# EAGLE design dev_board (EAGLE 8.0.1)
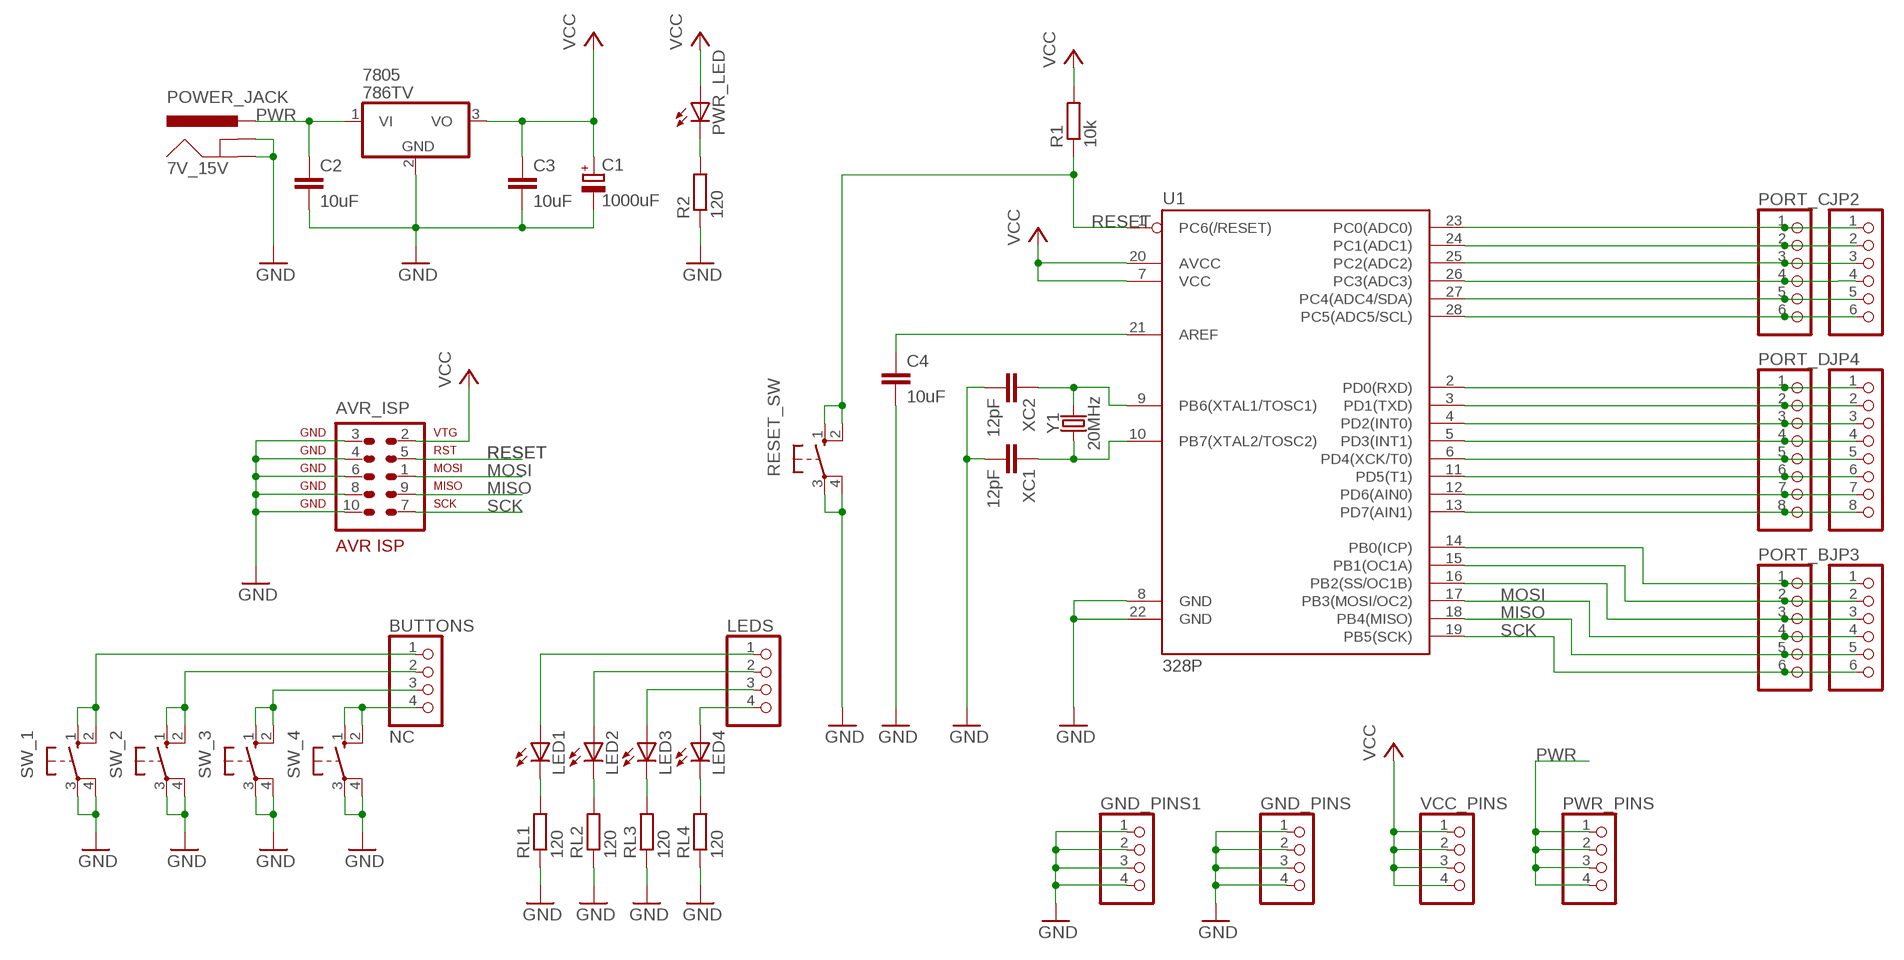
[diagram p0: schematic, sheet 1]

## Parts
7V_15V  POWER_JACK  [POWER_JACK_PTH]
7805  786TV  [TO220V]
AVR_ISP  AVR-ISP-10  [AVR-ISP-10]
BUTTONS  NC  PINHD-1X4  [1X04]
C1  1000uF  CPOL-EUE3.5-10  [E3,5-10]
C2  10uF  C-EU025-025X050  [C025-025X050]
C3  10uF  C-EU025-025X050  [C025-025X050]
C4  10uF  C-EU025-025X050  [C025-025X050]
GND_PINS  PINHD-1X4  [1X04]
GND_PINS1  PINHD-1X4  [1X04]
JP2  PINHD-1X6  [1X06]
JP3  PINHD-1X6  [1X06]
JP4  PINHD-1X8  [1X08]
LED1  LED5MM  [LED5MM]
LED2  LED5MM  [LED5MM]
LED3  LED5MM  [LED5MM]
LED4  LED5MM  [LED5MM]
LEDS  PINHD-1X4  [1X04]
PORT_B  PINHD-1X6  [1X06]
PORT_C  PINHD-1X6  [1X06]
PORT_D  PINHD-1X8  [1X08]
PWR_LED  LED3MM  [LED3MM]
PWR_PINS  PINHD-1X4  [1X04]
R1  10k  R-EU_0207/10  [0207/10]
R2  120  R-EU_0207/10  [0207/10]
RESET_SW  10-XX  [B3F-10XX]
RL1  120  R-EU_0207/10  [0207/10]
RL2  120  R-EU_0207/10  [0207/10]
RL3  120  R-EU_0207/10  [0207/10]
RL4  120  R-EU_0207/10  [0207/10]
SW_1  10-XX  [B3F-10XX]
SW_2  10-XX  [B3F-10XX]
SW_3  10-XX  [B3F-10XX]
SW_4  10-XX  [B3F-10XX]
U1  328P  ATMEGA328P_PDIP  [DIP28]
VCC_PINS  PINHD-1X4  [1X04]
XC1  12pF  C-EU025-025X050  [C025-025X050]
XC2  12pF  C-EU025-025X050  [C025-025X050]
Y1  20MHz  CRYSTALPTH-HC49US  [HC49US]

## Nets
GND: 7V_15V.GND 7V_15V.GNDBREAK 7805.2(GND) AVR_ISP.3 AVR_ISP.4 AVR_ISP.6 AVR_ISP.8 AVR_ISP.10 C1.- C2.2 C3.2 C4.2 GND_PINS1.1 GND_PINS1.2 GND_PINS1.3 GND_PINS1.4 GND_PINS.1 GND_PINS.2 GND_PINS.3 GND_PINS.4 R2.1 RESET_SW.3(P) RESET_SW.4(P1) RL1.1 RL2.1 RL3.1 RL4.1 SW_1.3(P) SW_1.4(P1) SW_2.3(P) SW_2.4(P1) SW_3.3(P) SW_3.4(P1) SW_4.3(P) SW_4.4(P1) U1.8(GND) U1.22(GND) XC1.2 XC2.2
MISO: AVR_ISP.9 JP3.5 PORT_B.5 U1.18(PB4(MISO))
MOSI: AVR_ISP.1 JP3.4 PORT_B.4 U1.17(PB3(MOSI/OC2))
N$2: C4.1 U1.21(AREF)
N$3: JP4.1 PORT_D.1 U1.2(PD0(RXD))
N$4: JP4.2 PORT_D.2 U1.3(PD1(TXD))
N$5: PWR_LED.K(C) R2.2
N$6: JP4.3 PORT_D.3 U1.4(PD2(INT0))
N$7: U1.9(PB6(XTAL1/TOSC1)) XC2.1 Y1.2
N$8: U1.10(PB7(XTAL2/TOSC2)) XC1.1 Y1.1
N$9: JP4.4 PORT_D.4 U1.5(PD3(INT1))
N$10: JP4.5 PORT_D.5 U1.6(PD4(XCK/T0))
N$11: JP4.6 PORT_D.6 U1.11(PD5(T1))
N$12: JP4.7 PORT_D.7 U1.12(PD6(AIN0))
N$13: JP4.8 PORT_D.8 U1.13(PD7(AIN1))
N$14: JP2.6 PORT_C.6 U1.28(PC5(ADC5/SCL))
N$15: JP2.5 PORT_C.5 U1.27(PC4(ADC4/SDA))
N$16: JP2.4 PORT_C.4 U1.26(PC3(ADC3))
N$17: JP2.3 PORT_C.3 U1.25(PC2(ADC2))
N$18: JP2.2 PORT_C.2 U1.24(PC1(ADC1))
N$19: JP2.1 PORT_C.1 U1.23(PC0(ADC0))
N$20: JP3.1 PORT_B.1 U1.14(PB0(ICP))
N$21: JP3.2 PORT_B.2 U1.15(PB1(OC1A))
N$22: JP3.3 PORT_B.3 U1.16(PB2(SS/OC1B))
N$23: LED4.K(C) RL4.2
N$24: LED3.K(C) RL3.2
N$25: LED2.K(C) RL2.2
N$26: LED1.K(C) RL1.2
N$27: LED4.A LEDS.4
N$28: LED3.A LEDS.3
N$29: LED2.A LEDS.2
N$30: LED1.A LEDS.1
N$31: BUTTONS.4 SW_4.1(S) SW_4.2(S1)
N$32: BUTTONS.3 SW_3.1(S) SW_3.2(S1)
N$33: BUTTONS.2 SW_2.1(S) SW_2.2(S1)
N$34: BUTTONS.1 SW_1.1(S) SW_1.2(S1)
PWR: 7V_15V.PWR 7805.1(VI) C2.1 PWR_PINS.1 PWR_PINS.2 PWR_PINS.3 PWR_PINS.4
RESET: AVR_ISP.5 R1.1 RESET_SW.1(S) RESET_SW.2(S1) U1.1(PC6(/RESET))
SCK: AVR_ISP.7 JP3.6 PORT_B.6 U1.19(PB5(SCK))
VCC: 7805.3(VO) AVR_ISP.2 C1.+ C3.1 PWR_LED.A R1.2 U1.7(VCC) U1.20(AVCC) VCC_PINS.1 VCC_PINS.2 VCC_PINS.3 VCC_PINS.4

## Library data of the parts
7V_15V = SparkFun-Connectors:POWER_JACK: Power Jack Connector This is the standard 5.5mm barrel jack for power. The PTH is the most common, proven, reliable, footprint. The Slot footprint only works if the mill layer is transmitted to the PCB fab house so be warned. Here are the connectors we sell at SparkFun: DC Barrel Power Jack/Connector <https://www.sparkfun.com/products/119> (PRT-00119) DC Barrel Power Jack/Connector (SMD) <https://www.sparkfun.com/products/12748> (PRT-12748) DC Barrel Jack Adapter - Breadboard Compatible <https://www.sparkfun.com/products/10811> (PRT-10811) It is used on this SparkFun product (and many, many others): SparkFun RedBoard - Programmed with Arduino <https://www.sparkfun.com/products/12757> (DEV-12757) Also, if you need a mating power supply or connector, please check these out: Wall Adapter Power Supply - 9VDC 650mA <https://www.sparkfun.com/products/298> (TOL-00298) DC Barrel Jack Adapter - Male <https://www.sparkfun.com/products/10287> (PRT-10287); PROD_ID: CONN-08197
7805 = linear:78*: Positive VOLTAGE REGULATOR Source: http://cache.national.com/ds/LM/LM78L05.pdf http://www.fairchildsemi.com/ds/LM/LM7805.pdf
AVR_ISP = atmel:AVR-ISP-10: AVR ISP-10 Serial Programming Header
BUTTONS GND_PINS GND_PINS1 LEDS PWR_PINS VCC_PINS = pinhead:PINHD-1X4: PIN HEADER
C1 = rcl:CPOL-EU: POLARIZED CAPACITOR, European symbol
C2-C4 XC1 XC2 = rcl:C-EU: CAPACITOR, European symbol
JP2 JP3 PORT_B PORT_C = pinhead:PINHD-1X6: PIN HEADER
JP4 PORT_D = pinhead:PINHD-1X8: PIN HEADER
LED1-LED4 PWR_LED = led:LED: LED OSRAM: - CHIPLED LG R971, LG N971, LY N971, LG Q971, LY Q971, LO R971, LY R971 LH N974, LH R974 LS Q976, LO Q976, LY Q976 LO Q996 - Hyper CHIPLED LW Q18S LB Q993, LB Q99A, LB R99A - SideLED LS A670, LO A670, LY A670, LG A670, LP A670 LB A673, LV A673, LT A673, LW A673 LH A674 LY A675 LS A676, LA A676, LO A676, LY A676, LW A676 LS A679, LY A679, LG A679 - Hyper Micro SIDELED® LS Y876, LA Y876, LO Y876, LY Y876 LT Y87S - SmartLED LW L88C, LW L88S LB L89C, LB L89S, LG L890 LS L89K, LO L89K, LY L89K LS L896, LA L896, LO L896, LY L896 - TOPLED LS T670, LO T670, LY T670, LG T670, LP T670 LSG T670, LSP T670, LSY T670, LOP T670, LYG T670 LG T671, LOG T671, LSG T671 LB T673, LV T673, LT T673, LW T673 LH T674 LS T676, LA T676, LO T676, LY T676, LB T676, LH T676, LSB T676, LW T676 LB T67C, LV T67C, LT T67C, LS T67K, LO T67K, LY T67K, LW E67C LS E67B, LA E67B, LO E67B, LY E67B, LB E67C, LV E67C, LT E67C LW T67C LS T679, LY T679, LG T679 LS T770, LO T770, LY T770, LG T770, LP T770 LB T773, LV T773, LT T773, LW T773 LH T774 LS E675, LA E675, LY E675, LS T675 LS T776, LA T776, LO T776, LY T776, LB T776 LHGB T686 LT T68C, LB T68C - Hyper Mini TOPLED® LB M676 - Mini TOPLED Santana® LG M470 LS M47K, LO M47K, LY M47K Source: http://www.osram.convergy.de LUXEON: - LUMILED® LXK2-PW12-R00, LXK2-PW12-S00, LXK2-PW14-U00, LXK2-PW14-V00 LXK2-PM12-R00, LXK2-PM12-S00, LXK2-PM14-U00 LXK2-PE12-Q00, LXK2-PE12-R00, LXK2-PE12-S00, LXK2-PE14-T00, LXK2-PE14-U00 LXK2-PB12-K00, LXK2-PB12-L00, LXK2-PB12-M00, LXK2-PB14-N00, LXK2-PB14-P00, LXK2-PB14-Q00 LXK2-PR12-L00, LXK2-PR12-M00, LXK2-PR14-Q00, LXK2-PR14-R00 LXK2-PD12-Q00, LXK2-PD12-R00, LXK2-PD12-S00 LXK2-PH12-R00, LXK2-PH12-S00 LXK2-PL12-P00, LXK2-PL12-Q00, LXK2-PL12-R00 Source: www.luxeon.com KINGBRIGHT: KA-3528ASYC Source: www.kingbright.com
R1 R2 RL1-RL4 = resistor:R-EU_: RESISTOR, European symbol
RESET_SW SW_1-SW_4 = switch-omron:10-XX: OMRON SWITCH; MPN: B3F-1000; OC_FARNELL: 176432; OC_NEWARK: 36M3542
U1 = SparkFun-IC-Microcontroller:ATMEGA328P_PDIP: Atmel 328P Through hole ATMEGA328P uC used in the Arduino 32kb flash, 1k EEPROM, 2k SRAM Datasheet <http://www.sparkfun.com/datasheets/Components/SMD/ATMega328.pdf> SparkFun Products Storefront component: AVR 28 Pin 20MHz 32K 6A/D - ATMega328P <https://www.sparkfun.com/products/9061> (COM-09061) SparkFun Simon Says - Through-Hole Soldering Kit <https://www.sparkfun.com/products/10547> (KIT-10547) SparkFun Learn to Solder - Simon Says <https://www.sparkfun.com/products/13708> (KIT-13708) SparkFun BigTime Watch Kit <https://www.sparkfun.com/products/11734> (KIT-11734) SparkFun ClockIt <https://www.sparkfun.com/products/10930> (KIT-10930) SparkFun Serial Enabled LCD Kit <https://www.sparkfun.com/products/10097> (LCD-10097) SparkFun Simon Tilts - Through Hole Soldering Kit <https://www.sparkfun.com/products/12634> (KIT-12634) SparkFun Frequency Counter Kit <https://www.sparkfun.com/products/10140> (KIT-10140) FabFM Radio Kit <https://www.sparkfun.com/products/11043> (KIT-11043) SparkFun Binary Blaster Kit <https://www.sparkfun.com/products/12037> (KIT-12037) SparkFun Metro-Gnome <https://www.sparkfun.com/products/9236> (KIT-09236) ATmega328 with Arduino Optiboot (Uno) <https://www.sparkfun.com/products/10524> (DEV-10524); PROD_ID: IC-09136
Y1 = SparkFun-Clocks:CRYSTAL: Crystals (Generic) These are passive quartz crystals, which can be used as a clock source for a microcontroller. Crystal's are two-terminal devices. They require external "load" capacitors to generate an oscillating signal.

## Board
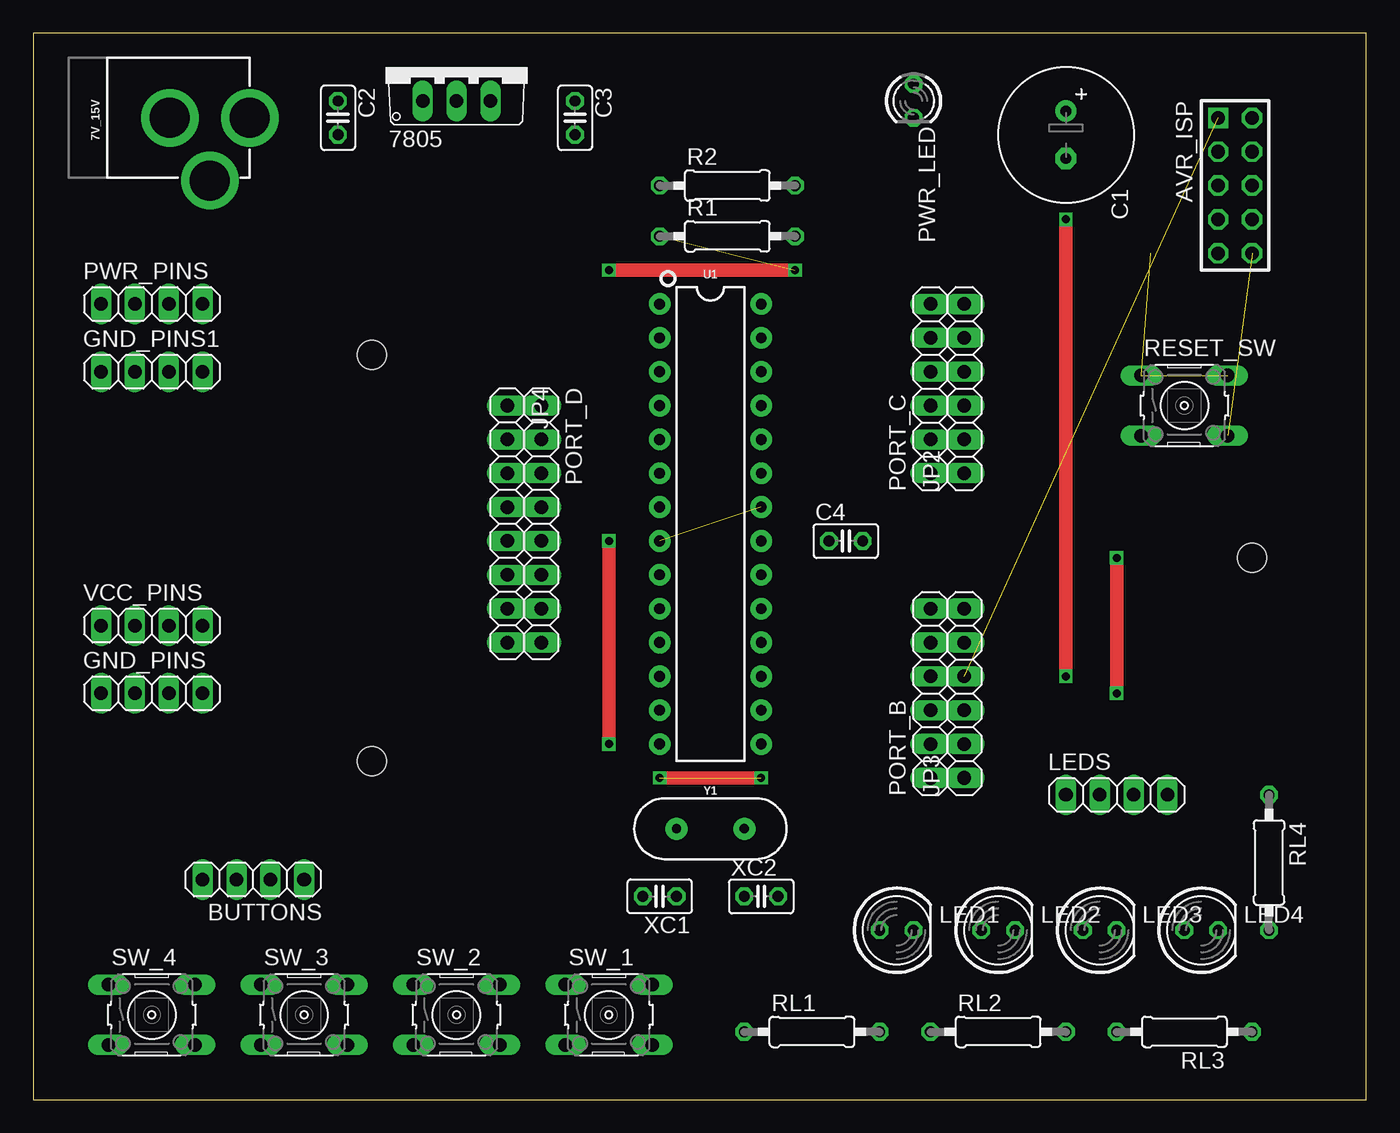
[diagram p1: board, top side]
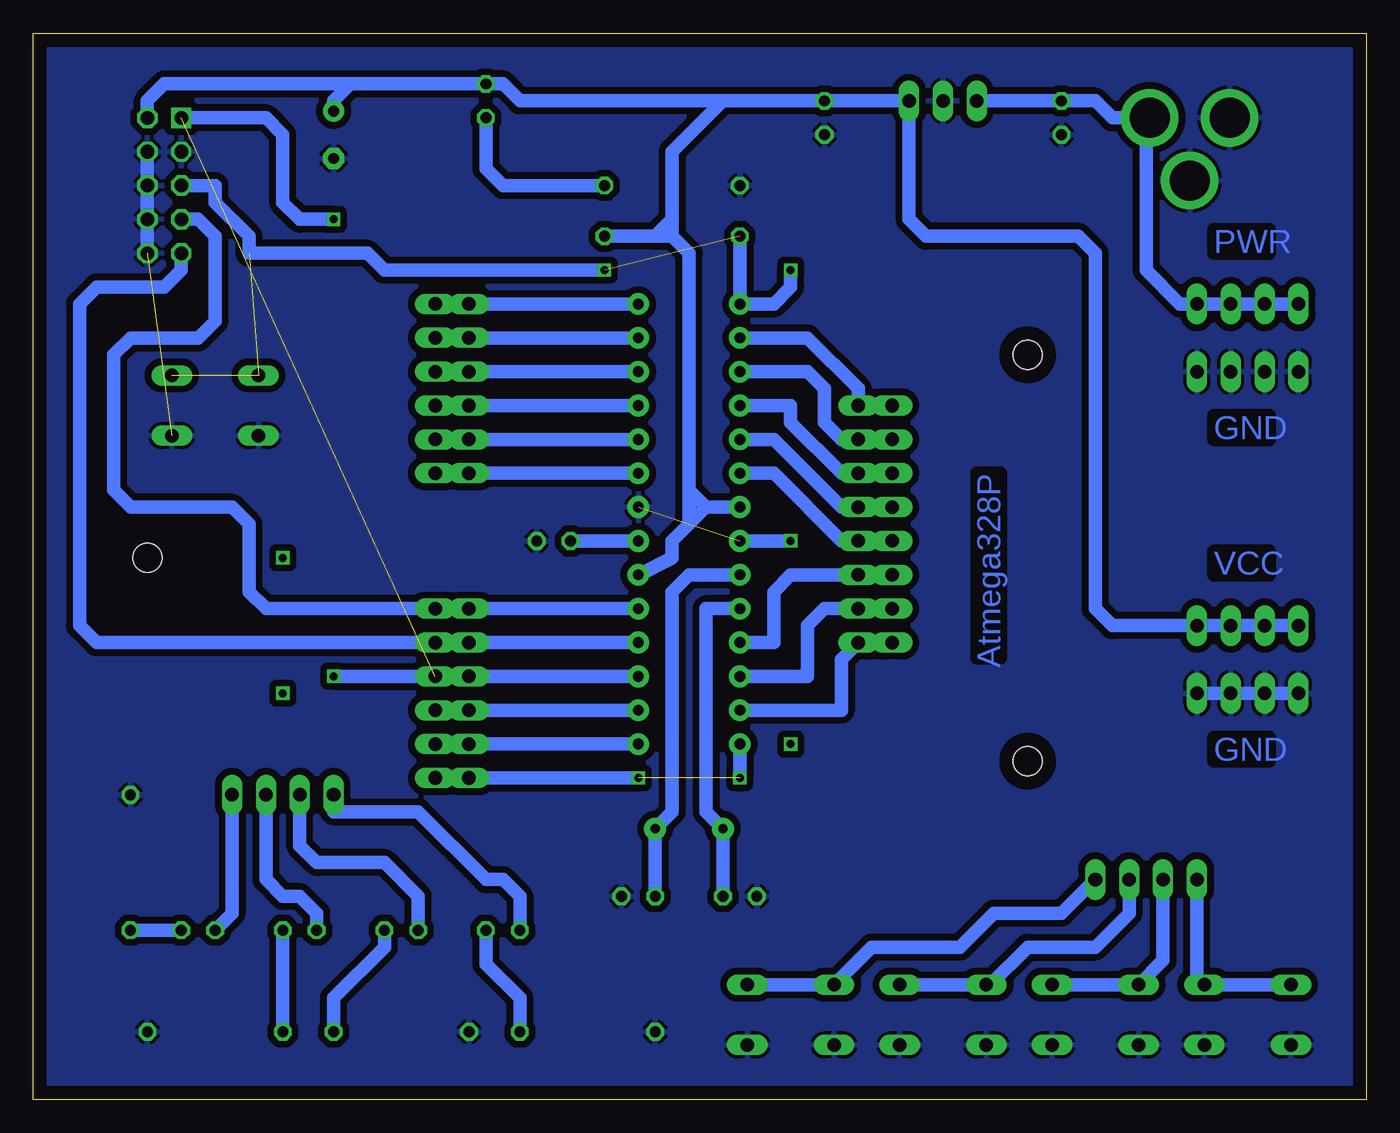
[diagram p2: board, bottom side, seen from below]

Size 100 x 80 mm. Coordinates in mm from the lower left corner, seen from the top.
Outline: 0,0 100,0 100,80 0,80 0,0
Copper layers (1*16): Top 0.035mm / dielectric 1.5mm / Bottom 0.035mm
Design rules "default": minimum track width 10mil, minimum drill 24mil, track to track 8mil, track to pad 8mil, pad to pad 8mil, via to via 8mil, smd to smd 8mil, copper to edge 40mil, drill to drill 8mil, minimum pad ring 10mil, minimum via ring 8mil, stop-mask expansion 4mil, vias tented up to drill 0mil, thermal gap 10mil
Holes 2.2 mm at 25.4,55.88 25.4,25.4 91.44,40.64

### Footprints (pad centres in the part's own frame; a part is rotated, then mirrored left to right if it is on the bottom)
POWER_JACK_PTH = drill 2.997 pad 4.318: GND 0,7.7; GNDBREAK 4.7,10.7; PWR 0,13.7
TO220V = drill 1.016 long: 1 -2.54,-2.54; 2 0,-2.54; 3 2.54,-2.54
AVR-ISP-10 = drill 1.016 square: 1 -5.08,-1.27 | drill 1.016 octagon: 2 -5.08,1.27; 3 -2.54,-1.27; 4 -2.54,1.27; 5 0,-1.27; 6 0,1.27; 7 2.54,-1.27; 8 2.54,1.27; 9 5.08,-1.27; 10 5.08,1.27
1X04 = drill 1.016 long: 1 -3.81,0; 2 -1.27,0; 3 1.27,0; 4 3.81,0
E3,5-10 = drill 0.813 pad 1.6: + -1.778,0 | drill 0.813 pad 1.6 octagon: - 1.778,0
C025-025X050 = drill 0.813 octagon: 1 -1.27,0; 2 1.27,0
1X06 = drill 1.016 long: 1 -6.35,0; 2 -3.81,0; 3 -1.27,0; 4 1.27,0; 5 3.81,0; 6 6.35,0
1X08 = drill 1.016 long: 1 -8.89,0; 2 -6.35,0; 3 -3.81,0; 4 -1.27,0; 5 1.27,0; 6 3.81,0; 7 6.35,0; 8 8.89,0
LED5MM = drill 0.813 octagon: A -1.27,0; K 1.27,0
LED3MM = drill 0.813 octagon: A -1.27,0; K 1.27,0
0207/10 = drill 0.813 octagon: 1 -5.08,0; 2 5.08,0
B3F-10XX = drill 1.016 long: 1 -3.251,2.261; 2 3.251,2.261; 3 -3.251,-2.261; 4 3.251,-2.261
DIP28 = drill 0.813 pad 1.626: 1 -16.51,-3.81; 2 -13.97,-3.81; 3 -11.43,-3.81; 4 -8.89,-3.81; 5 -6.35,-3.81; 6 -3.81,-3.81; 7 -1.27,-3.81; 8 1.27,-3.81; 9 3.81,-3.81; 10 6.35,-3.81; 11 8.89,-3.81; 12 11.43,-3.81; 13 13.97,-3.81; 14 16.51,-3.81; 15 16.51,3.81; 16 13.97,3.81; 17 11.43,3.81; 18 8.89,3.81; 19 6.35,3.81; 20 3.81,3.81; 21 1.27,3.81; 22 -1.27,3.81; 23 -3.81,3.81; 24 -6.35,3.81; 25 -8.89,3.81; 26 -11.43,3.81; 27 -13.97,3.81; 28 -16.51,3.81
HC49US = drill 0.7 pad 1.651: 1 -2.54,0; 2 2.54,0

### Placement (x,y rotation side)
7V_15V  2.54,73.66 270 top
7805  31.75,77.47 0 top
AVR_ISP  90.17,68.58 270 top
BUTTONS  16.51,16.51 180 top
C1  77.47,72.39 270 top
C2  22.86,73.66 270 top
C3  40.64,73.66 270 top
C4  60.96,41.91 0 top
GND_PINS  8.89,30.48 0 top
GND_PINS1  8.89,54.61 0 top
JP2  69.85,53.34 90 top
JP3  69.85,30.48 90 top
JP4  35.56,43.18 270 top
LED1  64.77,12.7 0 top
LED2  72.39,12.7 0 top
LED3  80.01,12.7 0 top
LED4  87.63,12.7 0 top
LEDS  81.28,22.86 0 top
PORT_B  67.31,30.48 90 top
PORT_C  67.31,53.34 90 top
PORT_D  38.1,43.18 270 top
PWR_LED  66.04,74.93 270 top
PWR_PINS  8.89,59.69 0 top
R1  52.07,64.77 0 top
R2  52.07,68.58 0 top
RESET_SW  86.36,52.07 0 top
RL1  58.42,5.08 0 top
RL2  72.39,5.08 0 top
RL3  86.36,5.08 180 top
RL4  92.71,17.78 270 top
SW_1  43.18,6.35 0 top
SW_2  31.75,6.35 0 top
SW_3  20.32,6.35 0 top
SW_4  8.89,6.35 0 top
U1  50.8,43.18 270 top
VCC_PINS  8.89,35.56 0 top
XC1  46.99,15.24 180 top
XC2  54.61,15.24 0 top
Y1  50.8,20.32 0 top

### Tracks (layer width: path | path; a pad name or v marks a point on that pad's centre or on a via)
GND  (2 unrouted)
  Bottom 1.016: AVR_ISP.4 AVR_ISP.6 AVR_ISP.8 AVR_ISP.10 | GND_PINS.1 GND_PINS.2 GND_PINS.3 GND_PINS.4
  pour Bottom: 0,81.28 -1.27,81.28 -1.27,-1.27 101.6,-1.27 101.6,81.28
MISO
  Bottom 1.016: U1.18 PORT_B.5 JP3.5 95.25,34.29 96.52,35.56 96.52,59.69 95.25,60.96 90.17,60.96 88.9,62.23 AVR_ISP.9
MOSI  (1 unrouted)
  Bottom 1.016: JP3.4 PORT_B.4 U1.17
N$2
  Bottom 1.016: U1.21 C4.1
N$3
  Bottom 1.016: JP4.1 PORT_D.1 38.1,53.34 41.91,57.15 U1.2
N$4
  Bottom 1.016: JP4.2 PORT_D.2 39.37,49.53 40.64,50.8 40.64,53.34 41.91,54.61 U1.3
N$5
  Bottom 1.016: R2.2 64.77,68.58 66.04,69.85 PWR_LED.K
N$6
  Bottom 1.016: JP4.3 PORT_D.3 39.37,46.99 43.18,50.8 43.18,52.07 U1.4
N$7
  Bottom 1.016: XC2.1 Y1.2 52.07,21.59 52.07,38.1 50.8,39.37 U1.9
N$8
  Bottom 1.016: XC1.1 Y1.1 49.53,21.59 49.53,36.83 U1.10
N$9
  Bottom 1.016: JP4.4 PORT_D.4 39.37,44.45 44.45,49.53 U1.5
N$10
  Bottom 1.016: JP4.5 PORT_D.5 39.37,41.91 44.45,46.99 U1.6
N$11
  Bottom 1.016: JP4.6 PORT_D.6 43.18,39.37 44.45,38.1 44.45,34.29 U1.11
N$12
  Bottom 1.016: JP4.7 PORT_D.7 40.64,36.83 41.91,35.56 41.91,31.75 U1.12
N$13
  Bottom 1.016: JP4.8 PORT_D.8 39.37,33.02 39.37,29.21 U1.13
N$14
  Bottom 1.016: JP2.6 PORT_C.6 U1.28
N$15
  Bottom 1.016: JP2.5 PORT_C.5 U1.27
N$16
  Bottom 1.016: JP2.4 PORT_C.4 U1.26
N$17
  Bottom 1.016: JP2.3 PORT_C.3 U1.25
N$18
  Bottom 1.016: JP2.2 PORT_C.2 U1.24
N$19
  Bottom 1.016: JP2.1 PORT_C.1 U1.23
N$20  (1 unrouted)
  Bottom 1.016: JP3.1 PORT_B.1 54.61,24.13 | U1.14 46.99,24.13
N$21
  Bottom 1.016: JP3.2 PORT_B.2 U1.15
N$22
  Bottom 1.016: JP3.3 PORT_B.3 U1.16
N$23
  Bottom 1.016: LED4.K RL4.2
N$24
  Bottom 1.016: LED3.K RL3.2
N$25
  Bottom 1.016: RL2.2 77.47,7.62 73.66,11.43 LED2.K
N$26
  Bottom 1.016: RL1.2 63.5,7.62 66.04,10.16 LED1.K
N$27
  Bottom 1.016: LEDS.4 85.09,13.97 LED4.A
N$28
  Bottom 1.016: LED3.A 78.74,13.97 80.01,15.24 81.28,15.24 82.55,16.51 LEDS.3
N$29
  Bottom 1.016: LED2.A 71.12,15.24 73.66,17.78 78.74,17.78 80.01,19.05 LEDS.2
N$30
  Bottom 1.016: LEDS.1 77.47,21.59 71.12,21.59 66.04,16.51 64.77,16.51 63.5,15.24 LED1.A
N$31
  Bottom 1.016: BUTTONS.4 12.7,8.61 SW_4.2 SW_4.1
N$32
  Bottom 1.016: BUTTONS.3 15.24,10.44 SW_3.1 SW_3.2
N$33
  Bottom 1.016: SW_2.2 SW_2.1 28.22,8.61 25.4,11.43 20.32,11.43 17.78,13.97 BUTTONS.2
N$34
  Bottom 1.016: SW_1.2 SW_1.1 37.11,11.43 30.48,11.43 27.94,13.97 22.86,13.97 BUTTONS.1
PWR
  Bottom 1.016: PWR_PINS.1 PWR_PINS.2 PWR_PINS.3 PWR_PINS.4 13.97,59.69 16.51,62.23 16.51,73.39 7V_15V.PWR | 7V_15V.PWR 19.05,73.66 20.32,74.93 C2.1 7805.1 | 7V_15V.PWR 16.51,73.66 16.51,74.93 15.24,74.93 15.24,72.39 17.14,72.39 17.14,74.93 15.88,74.93 15.88,73.03 16.24,73.03 7V_15V.PWR
RESET  (3 unrouted)
  Bottom 1.016: R1.1 U1.1 44.45,59.69 43.18,60.96 43.18,62.23 | 57.15,62.23 73.66,62.23 74.93,63.5 83.82,63.5 83.82,64.77 86.36,67.31 86.36,68.58 AVR_ISP.5
S$1  (via drill 0.6)
  other vias: 43.18,62.23
S$2  (via drill 0.6)
  Top 1.016: v57.15,62.23 43.18,62.23
S$3  (via drill 0.6)
  Top 1.016: v46.99,24.13 54.61,24.13
S$4  (via drill 0.6)
  other vias: 54.61,24.13
S$5  (via drill 0.6)
  Top 1.016: v43.18,41.91 43.18,26.67
  Bottom 1.016: v43.18,41.91 46.99,41.91
S$6  (via drill 0.6)
  other vias: 43.18,26.67
S$7  (via drill 0.6)
  Top 1.016: v81.28,40.64 81.28,30.48
S$8  (via drill 0.6)
  other vias: 81.28,30.48
S$9  (via drill 0.6)
  Top 1.016: v77.47,66.04 77.47,31.75
  Bottom 1.016: v77.47,66.04 80.01,66.04 81.28,67.31 81.28,72.39 82.55,73.66 88.9,73.66
S$10  (via drill 0.6)
  Bottom 1.016: v77.47,31.75 69.85,31.75
SCK
  Bottom 1.016: U1.19 PORT_B.6 JP3.6 82.55,36.83 83.82,38.1 83.82,43.18 85.09,44.45 92.71,44.45 93.98,45.72 93.98,55.88 92.71,57.15 87.63,57.15 86.36,58.42 86.36,64.77 87.63,66.04 AVR_ISP.7
VCC
  Bottom 1.016: 48.26,74.93 C3.1 7805.3 34.29,66.04 33.02,64.77 21.59,64.77 20.32,63.5 20.32,36.83 19.05,35.56 VCC_PINS.4 VCC_PINS.3 VCC_PINS.2 VCC_PINS.1 | 48.26,74.93 63.5,74.93 64.77,76.2 PWR_LED.A 76.2,76.2 | 48.26,74.93 52.07,71.12 52.07,66.04 | 52.7,65.41 52.07,66.04 | 52.7,65.41 53.34,64.77 | 53.34,64.77 R1.2 | 76.2,76.2 77.47,74.93 C1.+ | AVR_ISP.2 91.44,74.93 90.17,76.2 76.2,76.2 | U1.7 49.53,44.45 | 50.8,45.72 49.53,44.45 | 50.8,45.72 50.8,63.5 52.07,64.77 | 52.07,64.77 52.7,65.41 | 52.07,66.04 52.07,64.77 | 53.34,64.77 52.07,64.77 | U1.20 52.07,40.64 52.07,41.91 50.8,43.18 | 50.8,43.18 50.8,45.72 | 49.53,44.45 50.8,43.18

### Text on the board
Bottom: PWR | GND | Atmega328P | VCC | GND